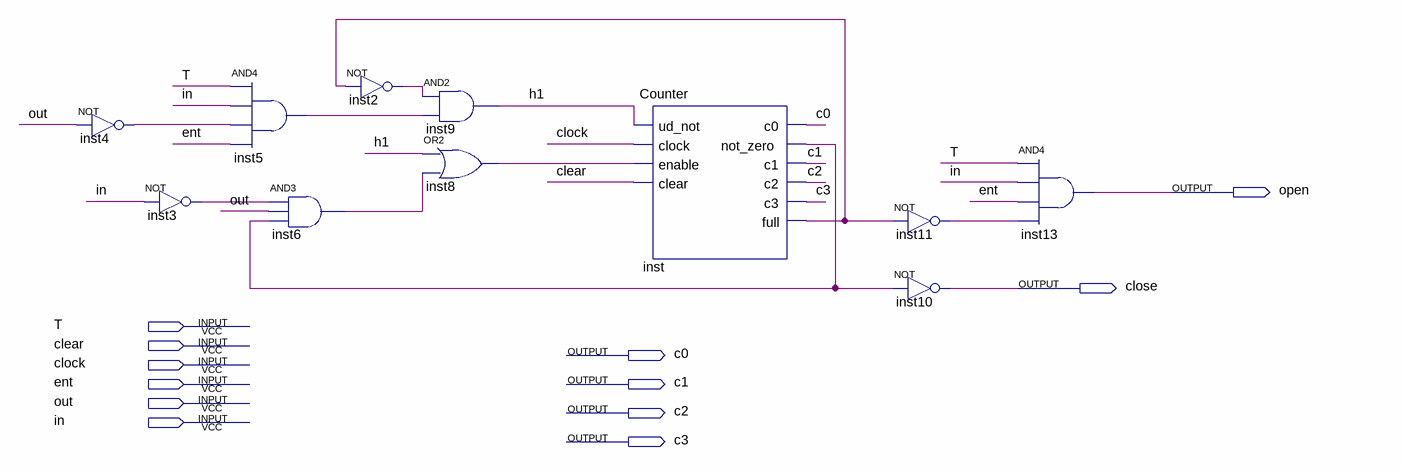
[diagram p0: schematic sheet]
// Quartus schematic Main.bdf as structural Verilog: 11 symbols, 12 pins
module Main (
  input  T,
  input  clear,
  input  clock,
  input  ent,
  input  out,
  input  in,
  output open,
  output close,
  output c0,
  output c1,
  output c2,
  output c3
);

  wire h1, inst2_out, inst3_out, inst4_out, inst5_out, inst6_out, inst8_out, inst11_out, inst_full,
       inst_not_zero;

  not inst4 (inst4_out, out);
  not inst3 (inst3_out, in);
  and inst5 (inst5_out, T, in, inst4_out, ent);
  and inst6 (inst6_out, inst3_out, out, inst_not_zero);
  not inst2 (inst2_out, inst_full);
  and inst9 (h1, inst2_out, inst5_out);
  or inst8 (inst8_out, h1, inst6_out);
  Counter inst (
    .ud_not(h1), .clock(clock), .enable(inst8_out), .clear(clear), .c0(c0), .not_zero(inst_not_zero),
    .c1(c1), .c2(c2), .c3(c3), .full(inst_full));
  not inst11 (inst11_out, inst_full);
  not inst10 (close, inst_not_zero);
  and inst13 (open, T, in, ent, inst11_out);
endmodule
